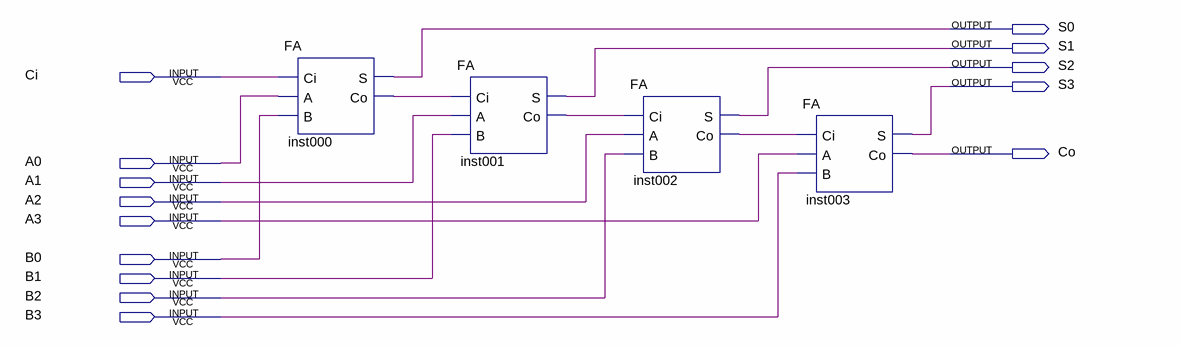
[diagram p0: schematic sheet]
// Quartus schematic RCA4.bdf as structural Verilog: 4 symbols, 14 pins
module RCA4 (
  input  Ci,
  input  A0,
  input  A1,
  input  A2,
  input  A3,
  input  B0,
  input  B1,
  input  B2,
  input  B3,
  output S0,
  output S1,
  output S2,
  output S3,
  output Co
);

  wire inst000_co, inst001_co, inst002_co;

  FA inst000 (.Ci(Ci), .A(A0), .B(B0), .S(S0), .Co(inst000_co));
  FA inst001 (.Ci(inst000_co), .A(A1), .B(B1), .S(S1), .Co(inst001_co));
  FA inst002 (.Ci(inst001_co), .A(A2), .B(B2), .S(S2), .Co(inst002_co));
  FA inst003 (.Ci(inst002_co), .A(A3), .B(B3), .S(S3), .Co(Co));
endmodule
